# Altium schematic sheet AnalogBreakout.SchDoc
size A4
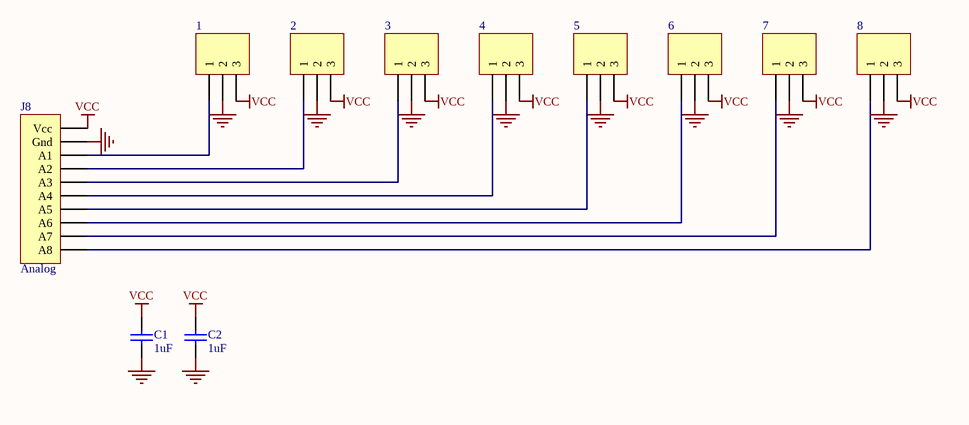
[diagram p0: AnalogBreakout.SchDoc]

## Parts
C1  value 1uF  [CAPPR2.5-6.3x7]  (hidden comment: Cap)
C2  value 1uF  [Cap SMD 1210]  (hidden comment: Cap)
J8  Analog  [0.1 SIP 10 PIN]
P1  1  [HDR1X3]
P2  2  [HDR1X3]
P3  3  [HDR1X3]
P4  4  [HDR1X3]
P5  5  [HDR1X3]
P6  6  [HDR1X3]
P7  7  [HDR1X3]
P8  8  [HDR1X3]

## Nets
GND: C1.2 C2.1 J8.2(Gnd) P1.2 P2.2 P3.2 P4.2 P5.2 P6.2 P7.2 P8.2
VCC: C1.1 C2.2 J8.1(Vcc) P1.3 P2.3 P3.3 P4.3 P5.3 P6.3 P7.3 P8.3
NetJ8_3: J8.3(A1) P1.1
NetJ8_4: J8.4(A2) P2.1
NetJ8_5: J8.5(A3) P3.1
NetJ8_6: J8.6(A4) P4.1
NetJ8_7: J8.7(A5) P5.1
NetJ8_8: J8.8(A6) P6.1
NetJ8_9: J8.9(A7) P7.1
NetJ8_10: J8.10(A8) P8.1

## Library data of the parts
C1 C2 = Cap: Capacitor; Published: 8-Jun-2000; LatestRevisionDate: 17-Jul-2002; LatestRevisionNote: Re-released for DXP Platform.; PackageReference: RAD-0.3; Publisher: Altium Limited; PackageDescription: Radial Cap, Thru-Hole; 2 Leads; 0.3 in Pin Spacing
J8 = Header 10: Header, 10-Pin; LatestRevisionDate: 17-Jul-2002; LatestRevisionNote: Re-released for DXP Platform.; Publisher: Altium Limited
P1-P8 = Header 3: Header, 3-Pin; LatestRevisionDate: 17-Jul-2002; LatestRevisionNote: Re-released for DXP Platform.; Publisher: Altium Limited